# Altium project XL991XT10W.PrjPCB
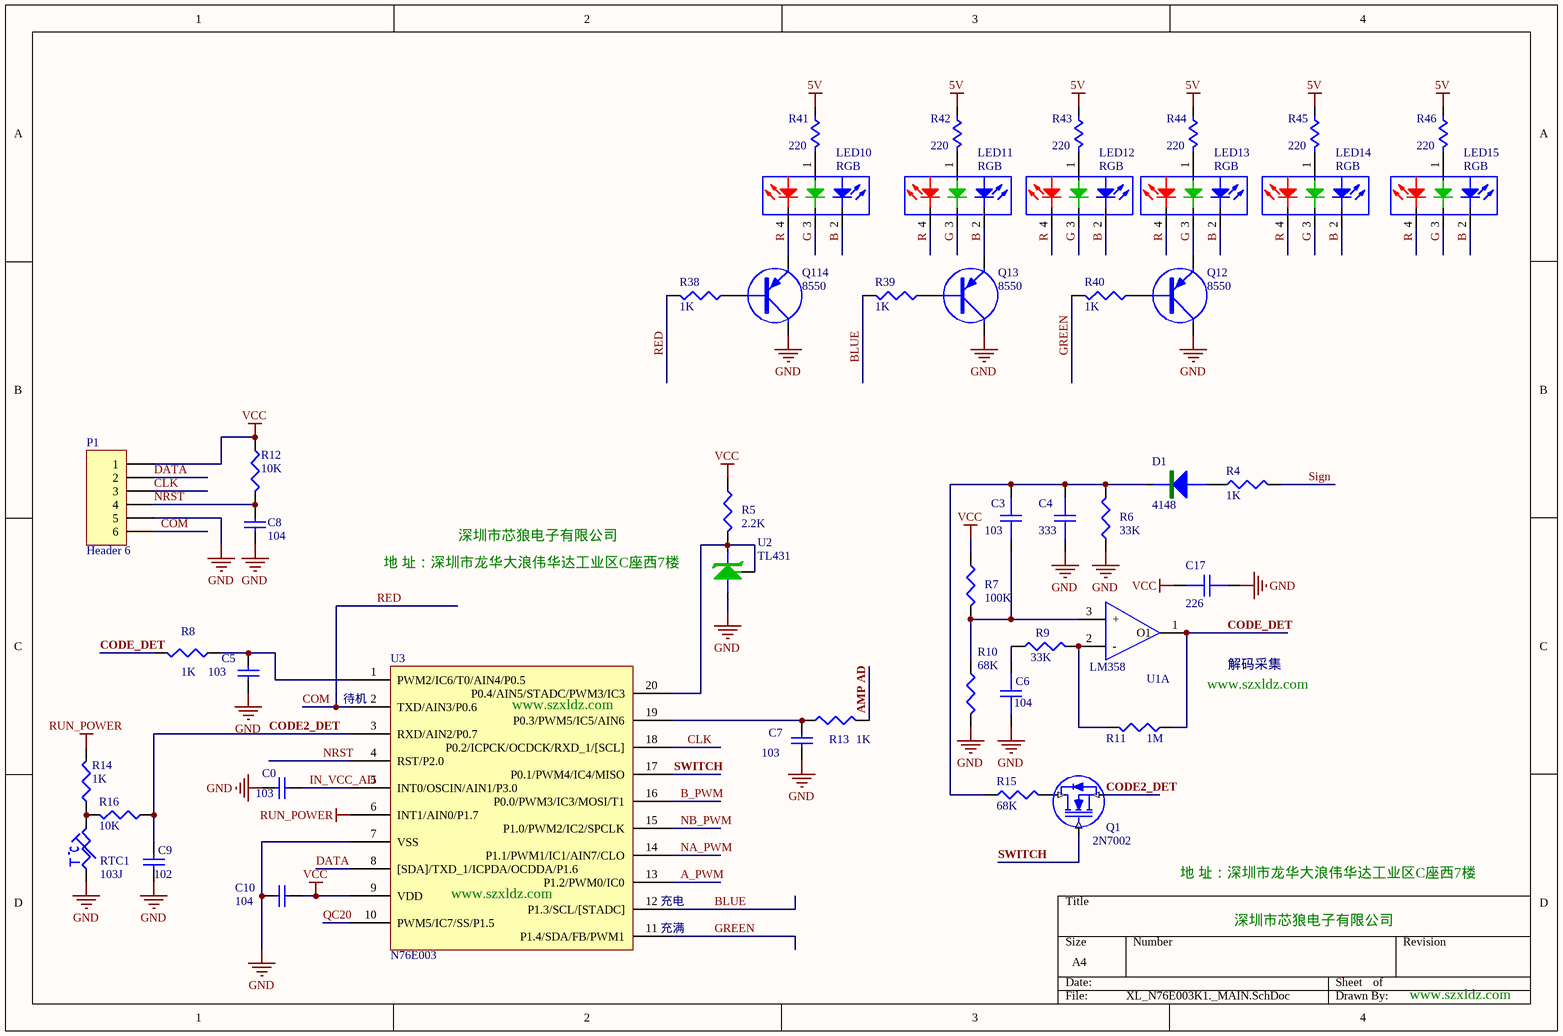
[diagram p0: XL_N76E003K1._MAIN.SchDoc]
2 sheets, 103 parts. Net scope: global (net labels, ports and power ports of the same name join across sheets).
Board files: XL991XT10W.PcbDoc, CESHIDEMODXF.PcbDoc
Sheets:
  XL_N76E003K1._MAIN.SchDoc
  XL_N76E003K1._POWER_V17.SchDoc

## Sheet XL_N76E003K1._MAIN.SchDoc
size A4

### Parts
C0  103  [C0402]
C3  103  [C0402]
C4  333  [C0402]
C5  103  [C0402]
C6  104  [C0402]
C7  103  [C0402]
C8  104  [C0402]
C9  102  [C0402]
C10  104  [C0402]
C17  226  [C0805]
D1  4148  [sod323]
LED10  RGB  [LED-RGB01]
LED11  RGB  [LED-RGB01]
LED12  RGB  [LED-RGB01]
LED13  RGB  [LED-RGB01]
LED14  RGB  [LED-RGB01]
LED15  RGB  [LED-RGB01]
P1  Header 6  [SPIN6]
Q1  2N7002  [SOT-23B]
Q12  8550  [SOT-23]
Q13  8550  [SOT-23]
Q114  8550  [SOT-23]
R4  1K  [R0402]
R5  2.2K  [R0402]
R6  33K  [R0402]
R7  100K  [R0402]
R8  1K  [R0402]
R9  33K  [R0402]
R10  68K  [R0402]
R11  1M  [R0402]
R12  10K  [R0402]
R13  1K  [R0402]
R14  1K  [R0402]
R15  68K  [R0402]
R16  10K  [R0402]
R38  1K  [R0402]
R39  1K  [R0402]
R40  1K  [R0402]
R41  220  [R0603]
R42  220  [R0603]
R43  220  [R0603]
R44  220  [R0603]
R45  220  [R0603]
R46  220  [R0603]
RTC1  103J  [R0402]
U1  LM358  [SOP8]  (part A of 2)
U2  TL431  [SOT-23-431]
U3  N76E003  [SOP20]

### Nets
5V: R41.1 R42.1 R43.1 R44.1 R45.1 R46.1
AMP AD: R13.2
GND: C0.1 C4.1 C5.1 C6.1 C7.2 C8.2 C9.1 C10.1 C17.1 P1.5 Q12.C Q13.C Q114.C R6.1 R10.2 RTC1.1 U2.1 U3.7(VSS)
RUN_POWER: R14.2 U3.6(INT1/AIN0/P1.7)
Sign: R4.2
VCC: C10.2 C17.2 P1.1 R5.1 R7.1 R12.1 U3.9(VDD)
A_PWM: U3.13(P1.2/PWM0/IC0)
B: LED10.2(A) LED11.2(A) LED12.2(A) LED13.2(A) LED14.2(A) LED15.2(A) Q13.E
B_PWM: U3.16(P0.0/PWM3/IC3/MOSI/T1)
BLUE: R39.2 U3.12(P1.3/SCL/[STADC])
CLK: P1.3 U3.18(P0.2/ICPCK/OCDCK/RXD_1/[SCL])
CODE2_DET: C9.2 Q1.E(S) R16.1 U3.3(RXD/AIN2/P0.7)
CODE_DET: R8.2 R11.1 U1.1(O1)
COM: P1.6 R38.2 U3.2(TXD/AIN3/P0.6)  [also labelled RED]
DATA: P1.2 U3.8([SDA]/TXD_1/ICPDA/OCDDA/P1.6)
G: LED10.3 LED11.3 LED12.3 LED13.3 LED14.3 LED15.3 Q12.E
GREEN: R40.2 U3.11(P1.4/SDA/FB/PWM1)
IN_VCC_AD: C0.2 U3.5(INT0/OSCIN/AIN1/P3.0)
NA_PWM: U3.14(P1.1/PWM1/IC1/AIN7/CLO)
NB_PWM: U3.15(P1.0/PWM2/IC2/SPCLK)
NRST: C8.1 P1.4 R12.2 U3.4(RST/P2.0)
QC20: U3.10(PWM5/IC7/SS/P1.5)
R: LED10.4 LED11.4 LED12.4 LED13.4 LED14.4 LED15.4 Q114.E
SWITCH: Q1.B(G) U3.17(P0.1/PWM4/IC4/MISO)
NetC3_1: C3.1 C4.2 D1.2 R6.2 R15.1
NetC3_2: C3.2 R7.2 R10.1 U1.3(+)
NetC5_2: C5.2 R8.1 U3.1(PWM2/IC6/T0/AIN4/P0.5)
NetC6_2: C6.2 R9.1
NetC7_1: C7.1 R13.1 U3.19(P0.3/PWM5/IC5/AIN6)
NetD1_1: D1.1 R4.1
NetLED10_1: LED10.1(A) R41.2
NetLED11_1: LED11.1(A) R42.2
NetLED12_1: LED12.1(A) R43.2
NetLED13_1: LED13.1(A) R44.2
NetLED14_1: LED14.1(A) R45.2
NetLED15_1: LED15.1(A) R46.2
NetQ1_C: Q1.C(D) R15.2
NetQ12_B: Q12.B R40.1
NetQ13_B: Q13.B R39.1
NetQ114_B: Q114.B R38.1
NetR5_2: R5.2 U2.2 U2.3 U3.20(P0.4/AIN5/STADC/PWM3/IC3)
NetR9_2: R9.2 R11.2 U1.2(-)
NetR14_1: R14.1 R16.2 RTC1.2

### Notes on the sheet
- 地 址：深圳市龙华大浪伟华达工业区C座西7楼
- 深圳市芯狼电子有限公司
- (near U3) 待机
- (near U3) www.szxldz.com
- www.szxldz.com
- 解码采集
- (near U3) 充电
- (near U3) 充满

### Library data of the parts
C0 C5 C7-C10 = Cap: Capacitor; Published: 8-Jun-2000; LatestRevisionDate: 17-Jul-2002; LatestRevisionNote: Re-released for DXP Platform.; Publisher: Altium Limited
  C5 C7: Value: 103
  C8: Value: 104
  C9: Value: 102
C3 C4 C6 C17 = CH
D1 = D0: 1N4001
LED10-LED15 = LED05
P1 = Header 6: Header, 6-Pin; LatestRevisionDate: 17-Jul-2002; LatestRevisionNote: Re-released for DXP Platform.; Publisher: Altium Limited
Q1 = MOSFETN
Q12 Q13 Q114 = PNP
R4 R8 R12-R14 R38-R40 = R
R5-R7 R9-R11 R15 R16 = R: 1K
R41-R46 = Res01
RTC1 = RTC
U1 = 4558
U2 = IC TL431: IC
U3 = 103F

## Sheet XL_N76E003K1._POWER_V17.SchDoc
size A4
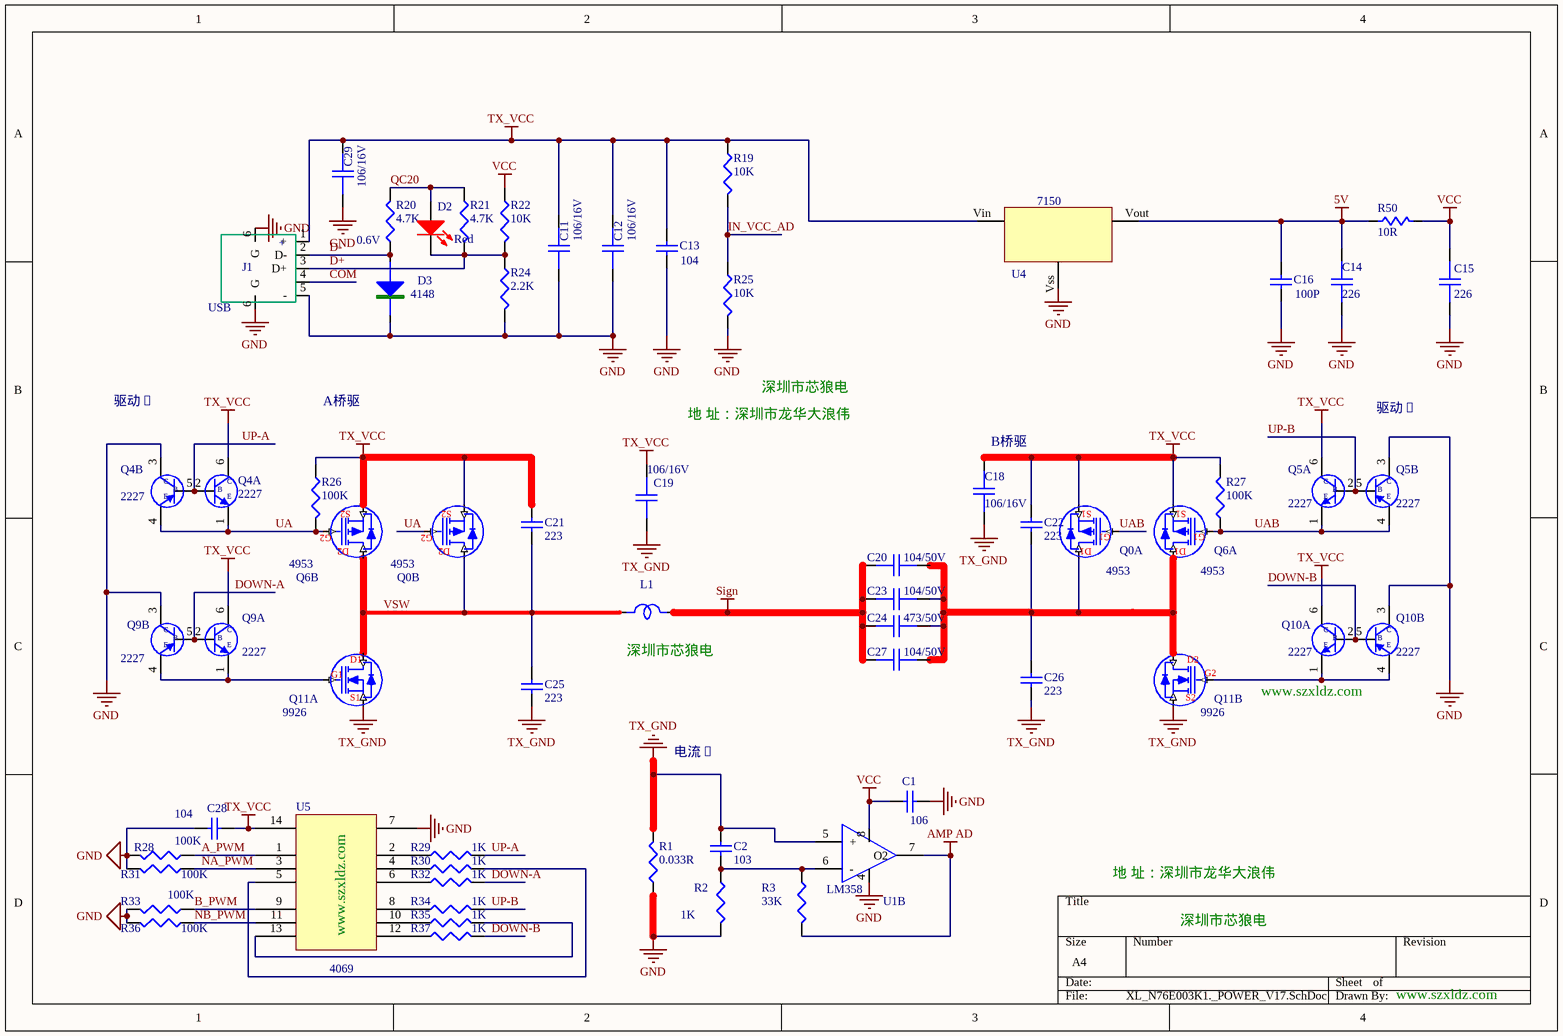
[diagram p1: XL_N76E003K1._POWER_V17.SchDoc]

### Parts
C1  106  [C0603]
C2  103  [C0402]
C11  106/16V  [C0805]
C12  106/16V  [C0805]
C13  104  [C0402]
C14  226  [C0805]
C15  226  [C0805]
C16  100P  [C0402]
C18  106/16V  [C0805]
C19  106/16V  [C0805]
C20  104/50V  [C1206]
C21  223  [C0603]
C22  223  [C0603]
C23  104/50V  [C1206]
C24  473/50V  [C1206]
C25  223  [C1206]
C26  223  [C0603]
C27  104/50V  [C1206]
C28  104  [C0402]
C29  106/16V  [C0805]
D2  Red  [LED0603]
D3  4148  [SOD323]
J1  USB  [USB MRO04]
L1  (no value)  [l5mm]
Q0  4953  [SOP8D]  (parts A,B of 2)
Q4  2227  [SOT363]  (parts A,B of 2)
Q5  2227  [SOT363]  (parts A,B of 2)
Q6  4953  [SOP8D]  (parts A,B of 2)
Q9  2227  [SOT363]  (parts A,B of 2)
Q10  2227  [SOT363]  (parts A,B of 2)
Q11  9926  [SOP8D]  (parts A,B of 2)
R1  0.033R  [R0805]
R2  1K  [R0402]
R3  33K  [R0402]
R19  10K  [R0402]
R20  4.7K  [R0402]
R21  4.7K  [R0402]
R22  10K  [R0402]
R24  2.2K  [R0402]
R25  10K  [R0402]
R26  100K  [R0402]
R27  100K  [R0402]
R28  100K  [R0402]
R29  1K  [R0402]
R30  1K  [R0402]
R31  100K  [R0402]
R32  1K  [R0402]
R33  100K  [R0402]
R34  1K  [R0402]
R35  1K  [R0402]
R36  100K  [R0402]
R37  1K  [R0402]
R50  10R  [R0402]
U1  LM358  [SOP8]  (part B of 2)
U4  7150  [SOT89a]
U5  4069  [SOP14]

### Nets
5V: C14.1 C16.1 R50.1 U4.Vout
AMP AD: R3.2 U1.7(O2)
GND: C1.1 C11.2 C12.2 C13.2 C14.2 C15.1 C16.2 C28.1 C29.2 D3.2 J1.5(-) J1.6(G) Q4.3(C) Q5.3(C) Q9.3(C) Q10.3(C) R1.1 R2.2 R24.1 R25.1 R28.2 R31.2 R33.2 R36.2 U1.4 U4.Vss U5.7
Sign: C20.1 C23.1 C24.1 C27.1 L1.2
TX_GND: C2.1 C18.2 C19.2 C25.1 C26.1 Q11.E1(S1) Q11.E2(S2) R1.2 U1.5(+)
TX_VCC: C11.1 C12.1 C13.1 C18.1 C19.1 C21.2 C22.2 C28.2 C29.1 J1.1(+) Q0.E1(S1) Q0.E2(S2) Q4.6(C) Q5.6(C) Q6.E1(S1) Q6.E2(S2) Q9.6(C) Q10.6(C) R19.2 R26.1 R27.2 U4.Vin U5.14
VCC: C1.2 C15.2 R22.2 R50.2 U1.8
A_PWM: R28.1 U5.1
B_PWM: R33.1 U5.9
COM: J1.4
D+: D2.2(K) J1.3(D+) R21.1 R22.1 R24.2
D-: D3.1 J1.2(D-) R20.2
DOWN-A: Q9.2(B) Q9.5(B) R32.2
DOWN-B: Q10.2(B) Q10.5(B) R37.2
IN_VCC_AD: R19.1 R25.2
NA_PWM: R31.1 U5.3
NB_PWM: R36.1 U5.11
QC20: D2.1(A) R20.1 R21.2
UA: Q0.B2(G2) Q4.1(E) Q4.4(E) Q6.B2(G2) R26.2
UAB: Q0.B1(G1) Q5.1(E) Q5.4(E) Q6.B1(G1) R27.1
UP-A: Q4.2(B) Q4.5(B) R29.2
UP-B: Q5.2(B) Q5.5(B) R34.2
VSW: C21.1 C25.2 L1.1 Q0.C2(D2) Q6.C2(D2) Q11.C1(D1)
NetC2_2: C2.2 R2.1 R3.1 U1.6(-)
NetC20_2: C20.2 C22.1 C23.2 C24.2 C26.2 C27.2 Q0.C1(D1) Q6.C1(D1) Q11.C2(D2)
NetQ9_1: Q9.1(E) Q9.4(E) Q11.B1(G1)
NetQ10_1: Q10.1(E) Q10.4(E) Q11.B2(G2)
NetR29_1: R29.1 U5.2
NetR30_1: R30.1 U5.4
NetR30_2: R30.2 U5.5
NetR32_1: R32.1 U5.6
NetR34_1: R34.1 U5.8
NetR35_1: R35.1 U5.10
NetR35_2: R35.2 U5.13
NetR37_1: R37.1 U5.12

### Notes on the sheet
- 0.6V
- 驱动�
- A桥驱
- 地 址：深圳市龙华大浪伟
- 深圳市芯狼电
- (near C18) B桥驱
- (near L1) 深圳市芯狼电
- (near Q10) www.szxldz.com
- 电流�
- (near U5) www.szxldz.com
- www.szxldz.com

### Library data of the parts
C1 C2 C16 C21 C22 C25 C26 = Cap: Capacitor; Value: 104; Published: 8-Jun-2000; LatestRevisionDate: 17-Jul-2002; LatestRevisionNote: Re-released for DXP Platform.; Publisher: Altium Limited
C11 C12 C14 C15 C18-C20 C23 C24 C27 C29 = CH
C13 C28 = Cap: Capacitor; Published: 8-Jun-2000; LatestRevisionDate: 17-Jul-2002; LatestRevisionNote: Re-released for DXP Platform.; Publisher: Altium Limited; Value: 104
D2 = LED02
D3 = D0: 1N4001
J1 = USB5P
L1 = L: 1uH
Q0 Q6 = MOSFETP2
Q4 Q5 Q9 Q10 = N+PS
Q11 = MOSFETN2
R1 R3 R19-R22 R24-R28 R31 R33 R36 = R: 1K
R2 R29 R30 R32 R34 R35 R37 = R
R50 = Res01
U1 = 4558
U4 = VOLTREG
U5 = CD4069

## Nets that join several sheets
5V: XL_N76E003K1._MAIN (6 pins), XL_N76E003K1._POWER_V17 (C14.1 C16.1 R50.1 U4.Vout)
AMP AD: XL_N76E003K1._MAIN (R13.2), XL_N76E003K1._POWER_V17 (R3.2 U1.7)
GND: XL_N76E003K1._MAIN (18 pins), XL_N76E003K1._POWER_V17 (27 pins)
Sign: XL_N76E003K1._MAIN (R4.2), XL_N76E003K1._POWER_V17 (5 pins)
VCC: XL_N76E003K1._MAIN (7 pins), XL_N76E003K1._POWER_V17 (5 pins)
A_PWM: XL_N76E003K1._MAIN (U3.13), XL_N76E003K1._POWER_V17 (R28.1 U5.1)
B_PWM: XL_N76E003K1._MAIN (U3.16), XL_N76E003K1._POWER_V17 (R33.1 U5.9)
COM: XL_N76E003K1._MAIN (P1.6 R38.2 U3.2), XL_N76E003K1._POWER_V17 (J1.4)
IN_VCC_AD: XL_N76E003K1._MAIN (C0.2 U3.5), XL_N76E003K1._POWER_V17 (R19.1 R25.2)
NA_PWM: XL_N76E003K1._MAIN (U3.14), XL_N76E003K1._POWER_V17 (R31.1 U5.3)
NB_PWM: XL_N76E003K1._MAIN (U3.15), XL_N76E003K1._POWER_V17 (R36.1 U5.11)
QC20: XL_N76E003K1._MAIN (U3.10), XL_N76E003K1._POWER_V17 (D2.1 R20.1 R21.2)